# EAGLE design 2364_ROM-el_PLCC (EAGLE 7.7.0)
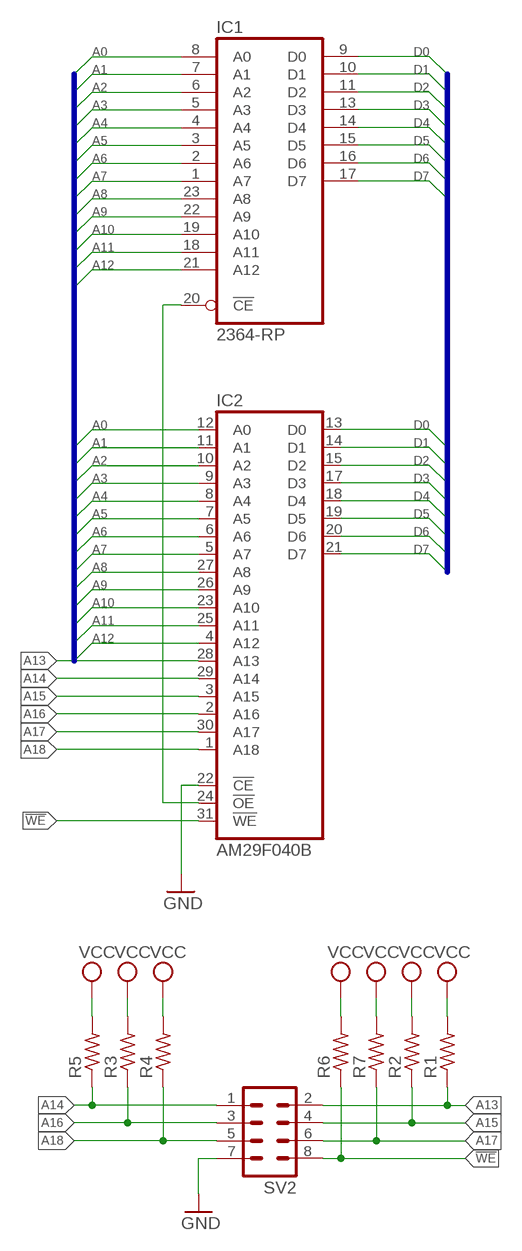
[diagram p0: schematic, sheet 1]

## Parts
IC1  2364-RP  [DIL24-ROUNDPAD]
IC2  AM29F040B  SST39SF040AN  [PLCC32R]
R1  R-US_R0402  [R0402]
R2  R-US_R0402  [R0402]
R3  R-US_R0402  [R0402]
R4  R-US_R0402  [R0402]
R5  R-US_R0402  [R0402]
R6  R-US_R0402  [R0402]
R7  R-US_R0402  [R0402]
SV2  MA04-2  [MA04-2]

## Nets
!OE: IC1.20(!CE) IC2.24(!OE)
!WE: IC2.31(!WE) R6.1 SV2.8
A0: IC1.8(A0) IC2.12(A0)
A1: IC1.7(A1) IC2.11(A1)
A2: IC1.6(A2) IC2.10(A2)
A3: IC1.5(A3) IC2.9(A3)
A4: IC1.4(A4) IC2.8(A4)
A5: IC1.3(A5) IC2.7(A5)
A6: IC1.2(A6) IC2.6(A6)
A7: IC1.1(A7) IC2.5(A7)
A8: IC1.23(A8) IC2.27(A8)
A9: IC1.22(A9) IC2.26(A9)
A10: IC1.19(A10) IC2.23(A10)
A11: IC1.18(A11) IC2.25(A11)
A12: IC1.21(A12) IC2.4(A12)
A13: IC2.28(A13) R1.1 SV2.2
A14: IC2.29(A14) R5.1 SV2.1
A15: IC2.3(A15) R2.1 SV2.4
A16: IC2.2(A16) R3.1 SV2.3
A17: IC2.30(A17) R7.1 SV2.6
A18: IC2.1(A18) R4.1 SV2.5
D0: IC1.9(D0) IC2.13(D0)
D1: IC1.10(D1) IC2.14(D1)
D2: IC1.11(D2) IC2.15(D2)
D3: IC1.13(D3) IC2.17(D3)
D4: IC1.14(D4) IC2.18(D4)
D5: IC1.15(D5) IC2.19(D5)
D6: IC1.16(D6) IC2.20(D6)
D7: IC1.17(D7) IC2.21(D7)
GND: IC2.22(!CE) SV2.7
VCC: R1.2 R2.2 R3.2 R4.2 R5.2 R6.2 R7.2

## Buses
D[0..7]
A[0..12]

## Power pins joined to a net without a drawn wire
GND: IC1.12(GND) IC2.16(GND)
VCC: IC1.24(VCC) IC2.32(VCC)

## Library data of the parts
IC1 = commodore:2364
IC2 = memory-sst:SST39SF040A: 4 Mbit x8 Multi-Purpose Flash Source: http://www.sst.com/dotAsset/40782.pdf
R1-R7 = resistor:R-US_: RESISTOR, American symbol
SV2 = con-lstb-rp:MA04-2: PIN HEADER; OC_FARNELL: unknown; OC_NEWARK: unknown

## Board
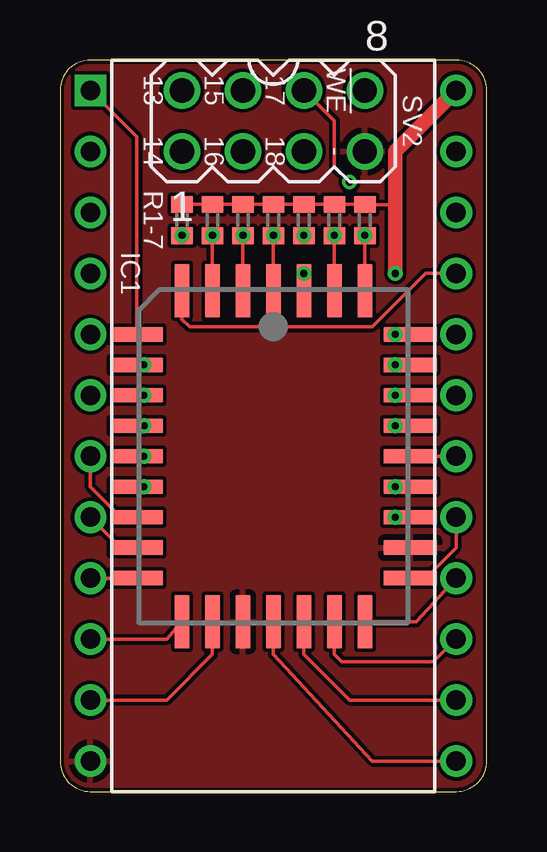
[diagram p1: board, top side]
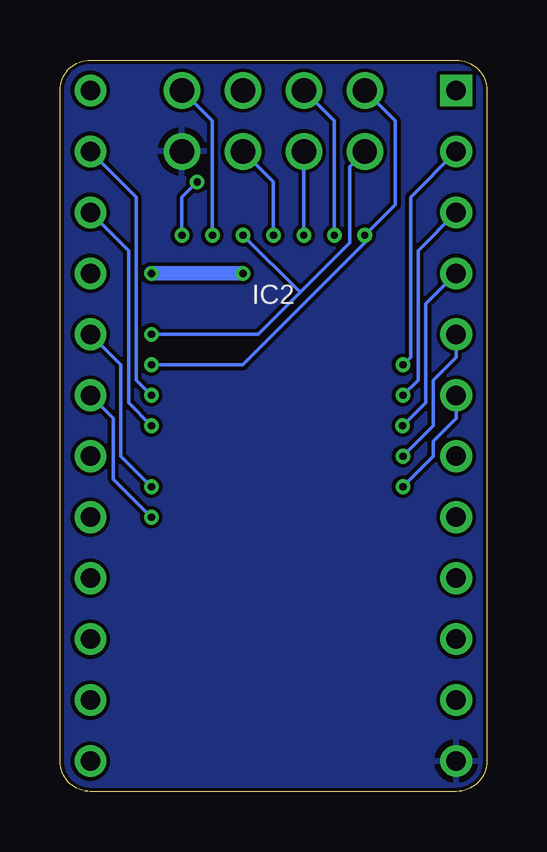
[diagram p2: board, bottom side, seen from below]

Size 17.78 x 30.48 mm. Coordinates in mm from the lower left corner, seen from the top.
Outline: 0,29.21 0,1.27 arc90 1.27,0 16.51,0 arc90 17.78,1.27 17.78,29.21 arc90 16.51,30.48 1.27,30.48 arc90 0,29.21
Copper layers (1*16): Top 0.035mm / dielectric 1.5mm / Bottom 0.035mm
Design rules "hackvana": minimum track width 6mil, minimum drill 0.3mm, track to track 6mil, track to pad 6mil, pad to pad 6mil, via to via 6mil, smd to smd 0mil, copper to edge 6mil, drill to drill 6mil, minimum pad ring 10mil, minimum via ring 6mil, stop-mask expansion 2mil, vias tented up to drill 100mil, thermal gap 10mil

### Footprints (pad centres in the part's own frame; a part is rotated, then mirrored left to right if it is on the bottom)
DIL24-ROUNDPAD = drill 0.813 square: 1 -13.97,-7.62 | drill 0.813: 2 -11.43,-7.62; 3 -8.89,-7.62; 4 -6.35,-7.62; 5 -3.81,-7.62; 6 -1.27,-7.62; 7 1.27,-7.62; 8 3.81,-7.62; 9 6.35,-7.62; 10 8.89,-7.62; 11 11.43,-7.62; 12 13.97,-7.62; 13 13.97,7.62; 14 11.43,7.62; 15 8.89,7.62; 16 6.35,7.62; 17 3.81,7.62; 18 1.27,7.62; 19 -1.27,7.62; 20 -3.81,7.62; 21 -6.35,7.62; 22 -8.89,7.62; 23 -11.43,7.62; 24 -13.97,7.62
PLCC32R = smd 0.6 x 2.2: 1 0,6.9; 2 -1.27,6.9; 3 -2.54,6.9; 4 -3.81,6.9; 14 -3.81,-6.9; 15 -2.54,-6.9; 16 -1.27,-6.9; 17 0,-6.9; 18 1.27,-6.9; 19 2.54,-6.9; 20 3.81,-6.9; 30 3.81,6.9; 31 2.54,6.9; 32 1.27,6.9 | smd 2.2 x 0.6: 5 -5.7,5.08; 6 -5.7,3.81; 7 -5.7,2.54; 8 -5.7,1.27; 9 -5.7,0; 10 -5.7,-1.27; 11 -5.7,-2.54; 12 -5.7,-3.81; 13 -5.7,-5.08; 21 5.7,-5.08; 22 5.7,-3.81; 23 5.7,-2.54; 24 5.7,-1.27; 25 5.7,0; 26 5.7,1.27; 27 5.7,2.54; 28 5.7,3.81; 29 5.7,5.08
R0402 = smd 0.7 x 0.9: 1 -0.65,0; 2 0.65,0
MA04-2 = drill 1.016: 1 -3.81,-1.27; 2 -3.81,1.27; 3 -1.27,-1.27; 4 -1.27,1.27; 5 1.27,-1.27; 6 1.27,1.27; 7 3.81,-1.27; 8 3.81,1.27

### Placement (x,y rotation side)
IC1  8.89,15.24 270 top
IC2  8.89,13.97 0 top
R1  5.08,23.81 90 top
R2  6.35,23.81 90 top
R3  7.62,23.81 90 top
R4  8.89,23.81 90 top
R5  10.16,23.81 90 top
R6  11.43,23.81 90 top
R7  12.7,23.81 90 top
SV2  8.89,27.94 0 top

### Tracks (layer width: path | path; a pad name or v marks a point on that pad's centre or on a via)
!OE  (via drill 0.3)
  Top 0.152: IC2.24 v13.97,12.7
  Bottom 0.152: v13.97,12.7 15.24,13.97 15.24,17.78 IC1.20
!WE  (via drill 0.3)
  Top 0.152: IC2.31 R6.1 v11.43,23.18
  Bottom 0.152: SV2.8 11.43,27.94 v11.43,23.18
A0
  Top 0.152: IC2.12 2.54,10.16 IC1.8
A1
  Top 0.152: IC2.11 2.54,11.43 1.27,12.7 IC1.7
A2  (via drill 0.3)
  Top 0.152: IC2.10 v3.49,12.7
  Bottom 0.152: v3.49,12.7 2.22,13.97 2.22,14.61 1.27,15.56 IC1.6
A3  (via drill 0.3)
  Top 0.152: IC2.9 v3.49,13.97
  Bottom 0.152: v3.49,13.97 2.22,15.24 2.22,17.14 1.27,18.1 IC1.5
A4  (via drill 0.3)
  Top 0.152: 3.18,15.24 IC2.8 v3.51,15.24
  Bottom 0.152: IC1.4 2.54,20.32 2.54,16.21 v3.51,15.24
A5  (via drill 0.3)
  Top 0.152: IC2.7 v3.49,16.51
  Bottom 0.152: v3.49,16.51 2.86,17.14 2.86,22.54 IC1.3
A6  (via drill 0.3)
  Top 0.152: IC2.6 v3.49,17.78
  Bottom 0.152: v3.49,17.78 3.18,18.1 3.18,24.77 IC1.2
A7
  Top 0.152: IC1.1 3.19,27.29 IC2.5
A8  (via drill 0.3)
  Top 0.152: IC2.27 v13.97,16.51
  Bottom 0.152: v13.97,16.51 14.61,17.14 14.61,24.77 IC1.23
A9  (via drill 0.3)
  Top 0.152: IC2.26 v13.97,15.24
  Bottom 0.152: v13.97,15.24 14.92,16.19 14.92,22.54 IC1.22
A10  (via drill 0.3)
  Top 0.152: IC2.23 v13.97,11.43
  Bottom 0.152: v13.97,11.43 15.56,13.02 15.56,15.56 IC1.19
A11
  Top 0.152: IC2.25 IC1.18
A12
  Top 0.152: IC2.4 5.08,19.68 5.4,19.37 13.02,19.37 15.24,21.59 IC1.21
A13  (via drill 0.3)
  Top 0.152: IC2.28 v13.97,17.78 | v5.08,23.18 R1.1
  Bottom 0.152: v13.97,17.78 10.16,17.78 5.08,22.86 v5.08,23.18 3.81,24.45 3.81,27.94 SV2.2
A14  (via drill 0.3)
  Top 0.152: IC2.29 v13.97,19.05 | R5.1 v10.16,23.18
  Bottom 0.152: v13.97,19.05 9.53,19.05 7.78,20.8 | 7.78,20.8 5.72,22.86 5.72,26.04 SV2.1 | v10.16,23.18 7.78,20.8
A15  (via drill 0.3)
  Top 0.152: IC2.3 R2.1 v6.35,23.18
  Bottom 0.152: SV2.4 6.35,27.94 v6.35,23.18
A16  (via drill 0.3)
  Top 0.152: IC2.2 R3.1 v7.62,23.18
  Bottom 0.152: SV2.3 v7.62,23.18
A17  (via drill 0.3)
  Top 0.152: IC2.30 R7.1 v12.7,23.18 | SV2.6 11.43,27.94 11.43,26.04 v12.07,25.4
  Bottom 0.152: v12.07,25.4 12.7,24.77 v12.7,23.18
A18  (via drill 0.3)
  Top 0.152: IC2.1 R4.1 v8.89,23.18
  Bottom 0.152: SV2.5 8.89,25.4 v8.89,23.18
D0
  Top 0.152: IC1.9 IC2.13
D1
  Top 0.152: IC1.10 4.45,6.35 IC2.14
D2
  Top 0.152: IC2.15 6.35,5.71 4.45,3.81 IC1.11
D3
  Top 0.152: IC2.17 8.89,5.71 13.02,1.27 IC1.13
D4
  Top 0.152: IC2.18 10.16,5.71 12.07,3.81 IC1.14
D5
  Top 0.152: IC2.19 11.43,5.71 11.75,5.4 15.56,5.4 IC1.15
D6
  Top 0.152: IC2.20 14.84,7.07 IC1.16
D7
  Top 0.152: IC2.21 15.24,8.89 16.51,10.16 IC1.17
GND
  pour Bottom: 17.78,29.21 17.78,1.27 arc-90 16.51,0 1.27,0 arc-90 0,1.27 0,29.21 arc-90 1.27,30.48 16.51,30.48 arc-90
  pour Top: 17.78,29.21 17.78,1.27 arc-90 16.51,0 1.27,0 arc-90 0,1.27 0,29.21 arc-90 1.27,30.48 16.51,30.48 arc-90
VCC  (via drill 0.3)
  Top 0.152: R1.2 R2.2 R3.2 R4.2 R5.2 R6.2 R7.2 12.71,24.45 13.97,24.45
  Top 0.61: IC1.24 13.97,26.67 13.97,24.45 v13.97,21.59 | v10.16,21.59 IC2.32
  Bottom 0.61: v13.97,21.59 v10.16,21.59

### Text on the board
tNames: 13 | 15 | 17 | !WE | 14 | 16 | 18 | - | R1-7